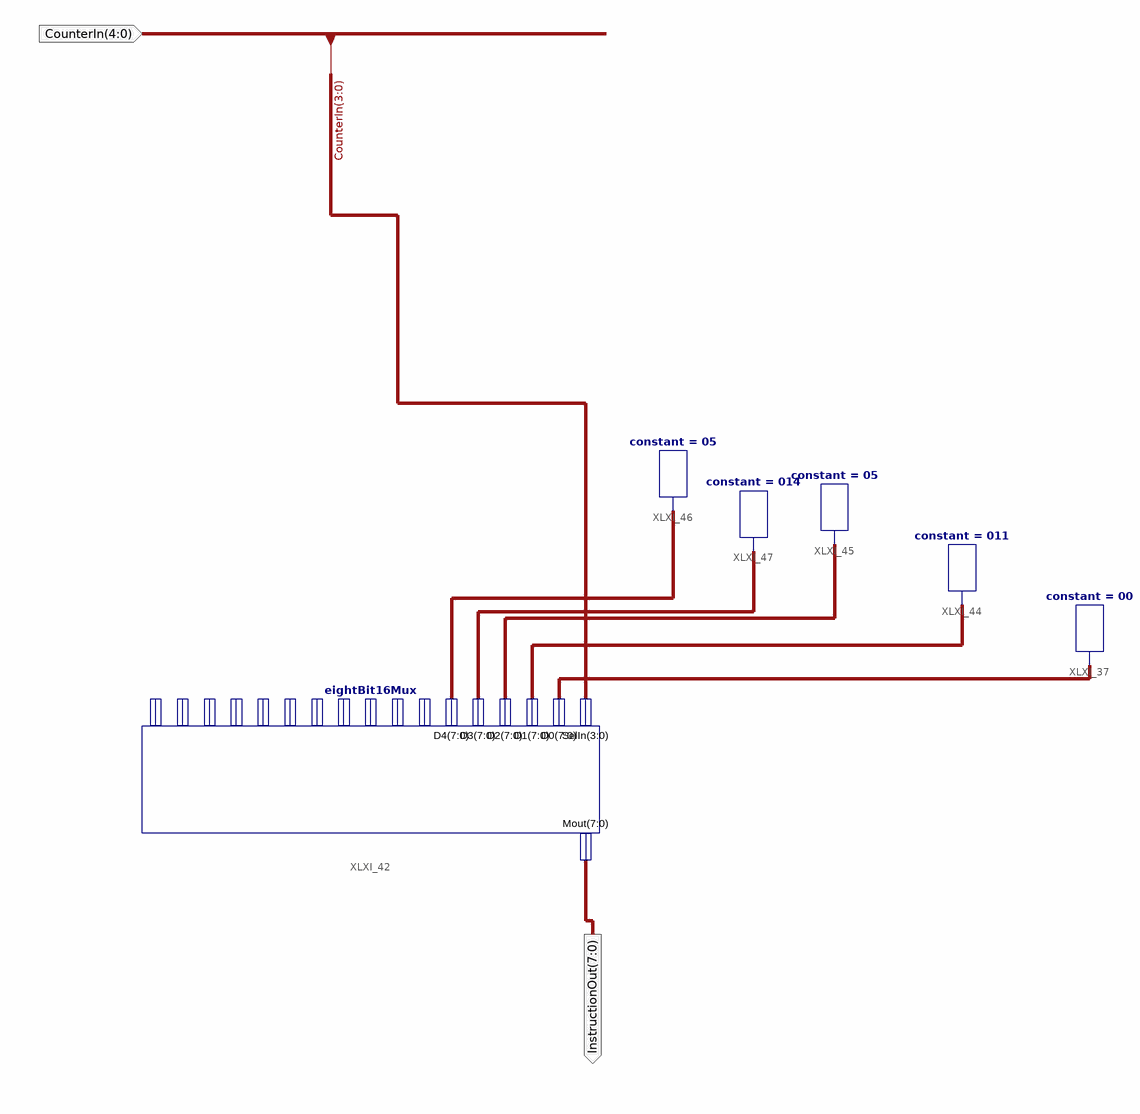
[diagram p0: schematic sheet 1]
// Xilinx ISE schematic HardInstructions.sch (spartan3e) as structural Verilog: 6 symbols, 2 ports
module HardInstructions (
  input  [4:0] CounterIn,
  output [7:0] InstructionOut
);

  wire [7:0] XLXN_62, XLXN_65, XLXN_66, XLXN_69, XLXN_70;

  eightBit16Mux XLXI_42 (
    .SelIn(CounterIn[3:0]), .D0(XLXN_62), .D1(XLXN_65), .D2(XLXN_66), .D3(XLXN_70), .D4(XLXN_69),
    .Mout(InstructionOut));  // open: D5, D6, D7, D8, D9, D10, D11, D12, D13, D14, D15
  constant #(.CValue("00")) XLXI_37 (.O(XLXN_62));
  constant #(.CValue("011")) XLXI_44 (.O(XLXN_65));
  constant #(.CValue("05")) XLXI_45 (.O(XLXN_66));
  constant #(.CValue("05")) XLXI_46 (.O(XLXN_69));
  constant #(.CValue("014")) XLXI_47 (.O(XLXN_70));
endmodule
